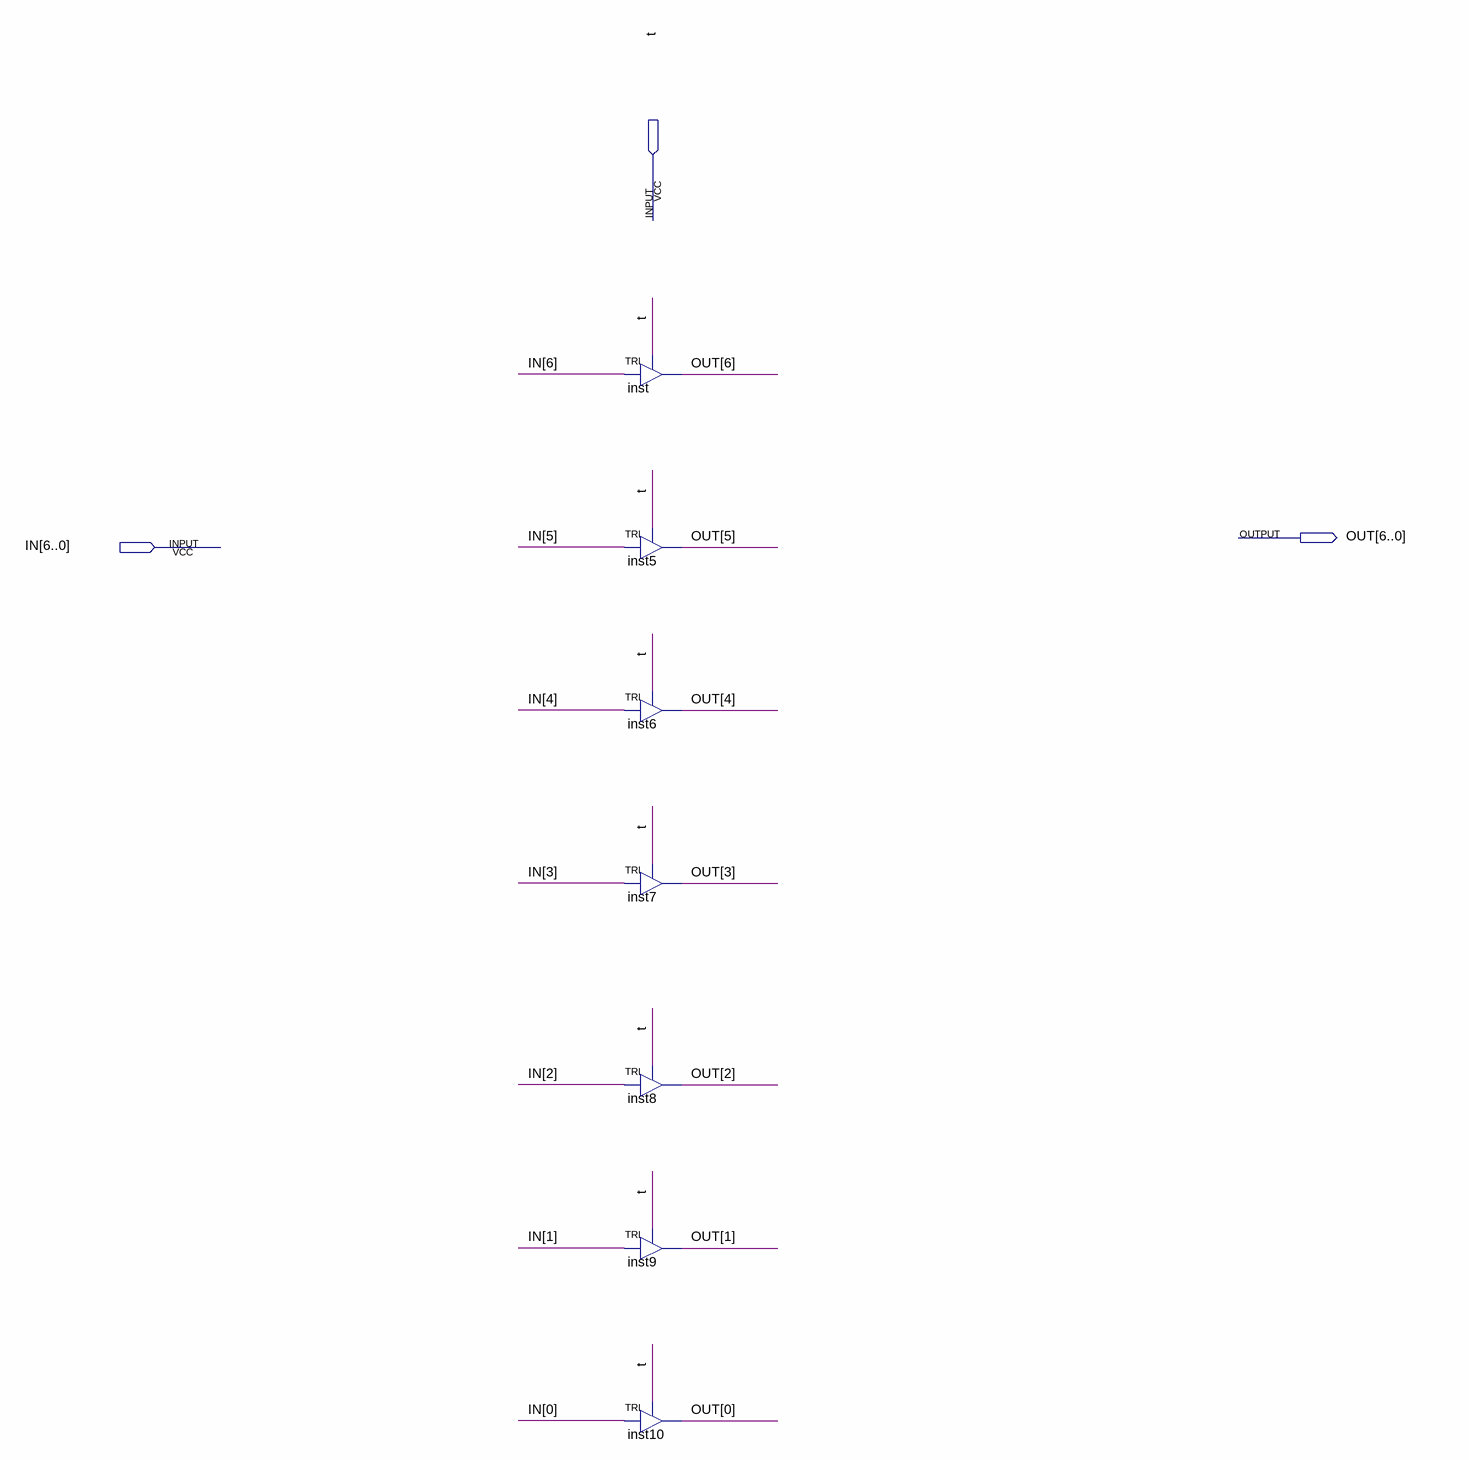
[diagram p0: schematic sheet]
// Quartus schematic TriBus_7bit.bdf as structural Verilog: 7 symbols, 3 pins
module TriBus_7bit (
  input  t,
  input  [6:0] IN,
  output [6:0] OUT
);

  TRI inst (.IN(IN[6]), .OE(t), .OUT(OUT[6]));
  TRI inst5 (.IN(IN[5]), .OE(t), .OUT(OUT[5]));
  TRI inst6 (.IN(IN[4]), .OE(t), .OUT(OUT[4]));
  TRI inst7 (.IN(IN[3]), .OE(t), .OUT(OUT[3]));
  TRI inst8 (.IN(IN[2]), .OE(t), .OUT(OUT[2]));
  TRI inst9 (.IN(IN[1]), .OE(t), .OUT(OUT[1]));
  TRI inst10 (.IN(IN[0]), .OE(t), .OUT(OUT[0]));
endmodule
